# EAGLE design BOT (EAGLE 9.6.2)
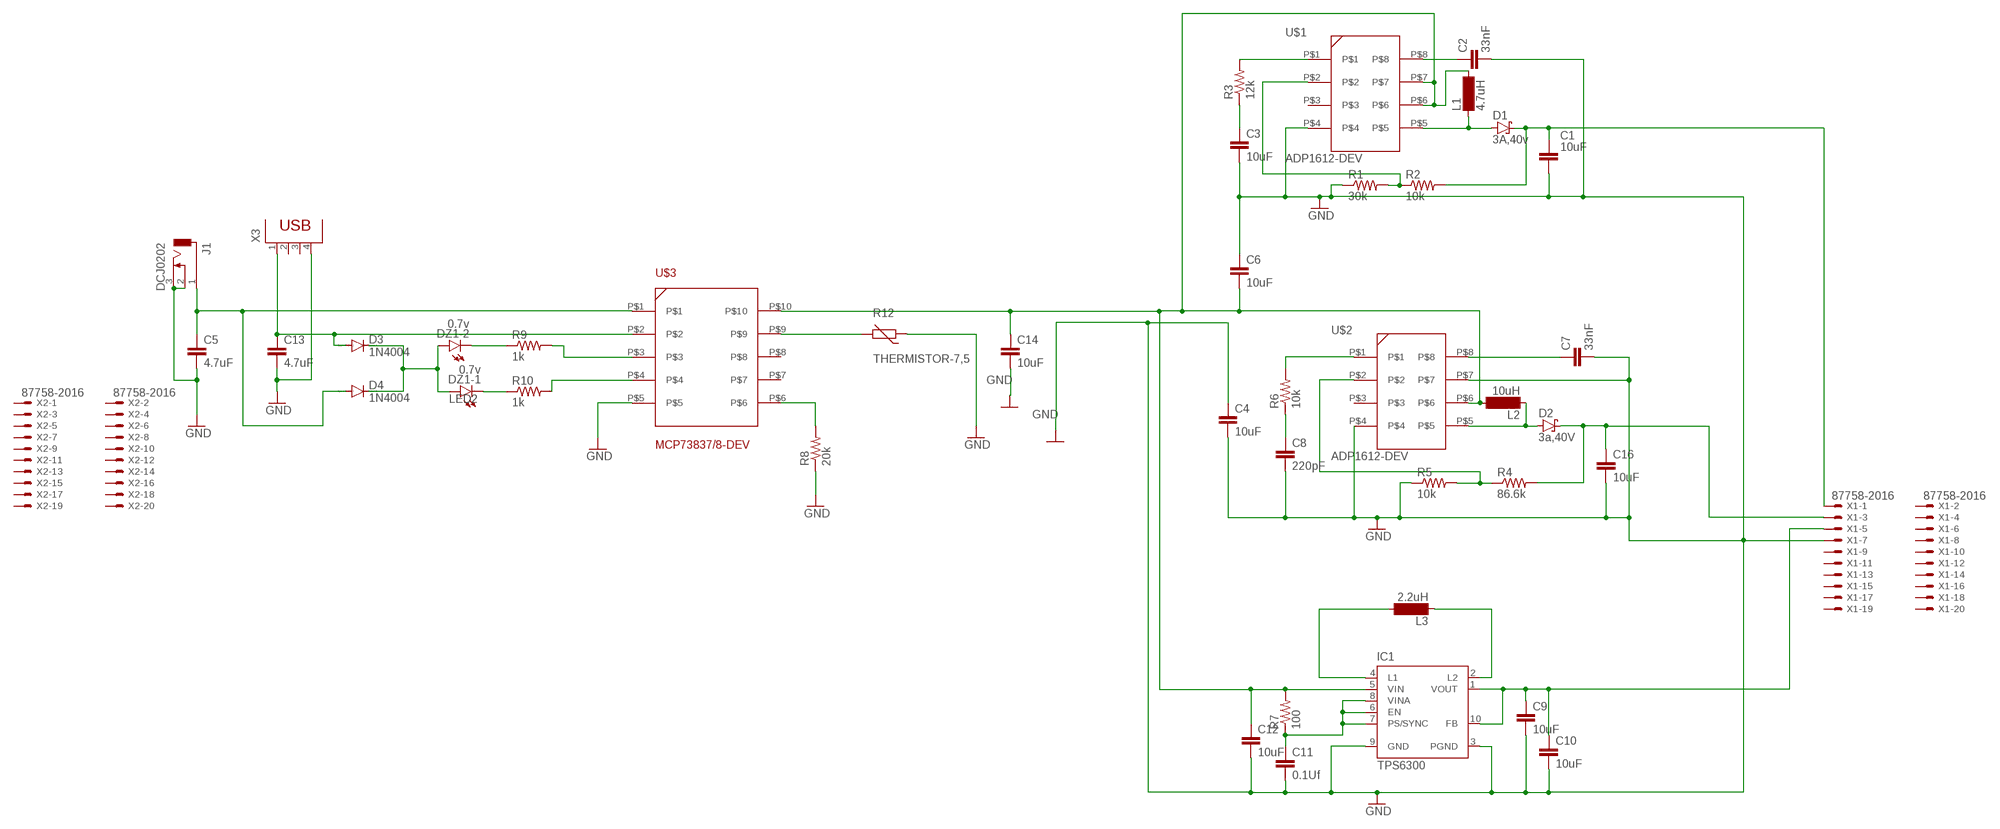
[diagram p0: schematic, sheet 1]

## Parts
C1  10uF  C  (no package)
C2  33nF  C2.5/2  [C2.5-2]
C3  10uF  C2.5/2  [C2.5-2]
C4  10uF  C2,5-3  [C2.5-3]
C5  4.7uF  C2.5/2  [C2.5-2]
C6  10uF  C2.5/2  [C2.5-2]
C7  33nF  C2,5-3  [C2.5-3]
C8  220pF  C2,5-3  [C2.5-3]
C9  10uF  C2,5-3  [C2.5-3]
C10  10uF  C2,5-3  [C2.5-3]
C11  0.1Uf  C2,5-3  [C2.5-3]
C12  10uF  C2,5-3  [C2.5-3]
C13  4.7uF  C2.5/2  [C2.5-2]
C14  10uF  C2.5/2  [C2.5-2]
C16  10uF  C2,5-3  [C2.5-3]
D1  3A,40v  BAT60J  [SOD323_ST]
D2  3a,40V  BAT60J  [SOD323_ST]
D3  1N4004  [DO41-10]
D4  1N4004  [DO41-10]
DZ1  0.7v  LZR182  [LZR182]
IC1  TPS6300  [DRC-S-PVSON-N10]
J1  DCJ0202  [DCJ0202]
L1  4.7uH  SD8  [SD8]
L2  10uH  SD8  [SD8]
L3  2.2uH  SD8  [SD8]
R1  30k  R-US_0204/5  [0204/5]
R2  10k  R-US_0204/5  [0204/5]
R3  12k  R-US_0204/5  [0204/5]
R4  86.6k  R-US_0204/5  [0204/5]
R5  10k  R-US_0204/5  [0204/5]
R6  10k  R-US_0204/5  [0204/5]
R7  100  R-US_0204/5  [0204/5]
R8  20k  R-US_0204/5  [0204/5]
R9  1k  R-US_0204/5  [0204/5]
R10  1k  R-US_0204/5  [0204/5]
R12  THERMISTOR-7,5  [R-7,5]
U$1  ADP1612-DEV  [MSOP-ADP1612]
U$2  ADP1612-DEV  [MSOP-ADP1612]
U$3  MCP73837/8-DEV  [MSOP-MCP73837/8]
X1  87758-2016  [87758-2016]
X2  87758-2016  [87758-2016]
X3  PN87520  [PN87520]

## Nets
GND: C1.2 C2.2 C3.2 C4.1 C4.2 C5.2 C6.1 C7.2 C8.2 C9.2 C10.2 C11.2 C12.2 C13.2 C14.2 C16.2 IC1.3(PGND) IC1.9(GND) J1.2 J1.3 R1.1 R5.1 R8.1 R12.1 U$1.P$4 U$2.P$4 U$2.P$7 U$3.P$5 X1.7 X3.4
LED2: D3.C D4.C DZ1.A1(-1:A) DZ1.A2(-2:A)
N$1: R3.2 U$1.P$1
N$2: C3.1 R3.1
N$3: C2.1 U$1.P$8
N$4: R8.2 U$3.P$6
N$5: D1.A L1.1 U$1.P$5
N$6: R1.2 R2.1 U$1.P$2
N$7: R6.2 U$2.P$1
N$8: C1.1 D1.C R2.2 X1.1
N$10: C8.1 R6.1
N$11: R9.2 U$3.P$3
N$12: D2.A L2.1 U$2.P$5
N$13: IC1.4(L1) L3.2
N$14: C7.1 U$2.P$8
N$15: R4.1 R5.2 U$2.P$2
N$16: C16.1 D2.C R4.2 X1.3
N$17: IC1.2(L2) L3.1
N$19: C9.1 C10.1 IC1.1(VOUT) IC1.10(FB) X1.5
N$20: C6.2 C12.1 C14.1 IC1.5(VIN) L1.2 L2.2 R7.2 U$1.P$6 U$1.P$7 U$2.P$6 U$3.P$10
N$22: C11.1 IC1.6(EN) IC1.7(PS/SYNC) IC1.8(VINA) R7.1
N$23: R12.2 U$3.P$9
N$24: DZ1.K2(-2:C) R9.1
N$25: DZ1.K1(-1:C) R10.1
N$28: C5.1 D4.A J1.1 U$3.P$1
N$30: R10.2 U$3.P$4
N$31: C13.1 D3.A U$3.P$2 X3.1
Unconnected: IC1.TH U$1.P$3 U$2.P$3 U$3.P$7 U$3.P$8 X1.2 X1.4 X1.6 X1.8 X1.9 X1.10 X1.11 X1.12 X1.13 X1.14 X1.15 X1.16 X1.17 X1.18 X1.19 X1.20 X2.1 X2.2 X2.3 X2.4 X2.5 X2.6 X2.7 X2.8 X2.9 X2.10 X2.11 X2.12 X2.13 X2.14 X2.15 X2.16 X2.17 X2.18 X2.19 X2.20 X3.2 X3.3

## Library data of the parts
C1 = ngspice-simulation:C: CAPACITOR naming: grid - package width
C2-C14 C16 = capacitor-wima:C: CAPACITOR naming: grid - package width
D1 D2 = diode:BAT60J: Schottky barrier diode Source: www.st.com, BAT60J.pdf
D3 D4 = diode:1N4004: DIODE general purpose rectifier, 1 A
DZ1 = led:LZR182: LED BLOCK 2 LEDs, Siemens
IC1 = texas:TPS6300*: HIGH EFFICIENT SINGLE INDUCTOR BUCK-BOOST CONVERTER WITH 1.8-A SWITCHES Source: http://focus.ti.com/lit/ds/symlink/tps63001.pdf; MPN: TPS63000DRCTG4; OC_FARNELL: 1511852; OC_NEWARK: 59M7217
J1 = con-jack:DCJ0202: DC POWER JACK Source: DCJ0202.pdf; OC_FARNELL: unknown; OC_NEWARK: unknown
L1-L3 = inductor-neosid:SD8: INDUCTOR nominal inductance; OC_FARNELL: unknown; OC_NEWARK: unknown
R1-R10 = rcl:R-US_: RESISTOR, American symbol; SPICEPREFIX: R
R12 = varistor:THERMISTOR: THERMISTOR
U$1 U$2 = num_cre(adp):ADP1612-DEV
U$3 = num_bat:MCP73837/8-DEV
X1 X2 = con-molex:87758-2016: 20 Pin - 2mm Dual Row Single Wafer, Vertical T/H HDR Source: http://www.molex.com/pdm_docs/sd/877580616_sd.pdf; MF: MOLEX; MPN: 87758-2016; OC_FARNELL: 7472374; OC_NEWARK: 25M5677
X3 = con-berg:PN87520: BERG USB connector; OC_FARNELL: unknown; OC_NEWARK: unknown

## Board
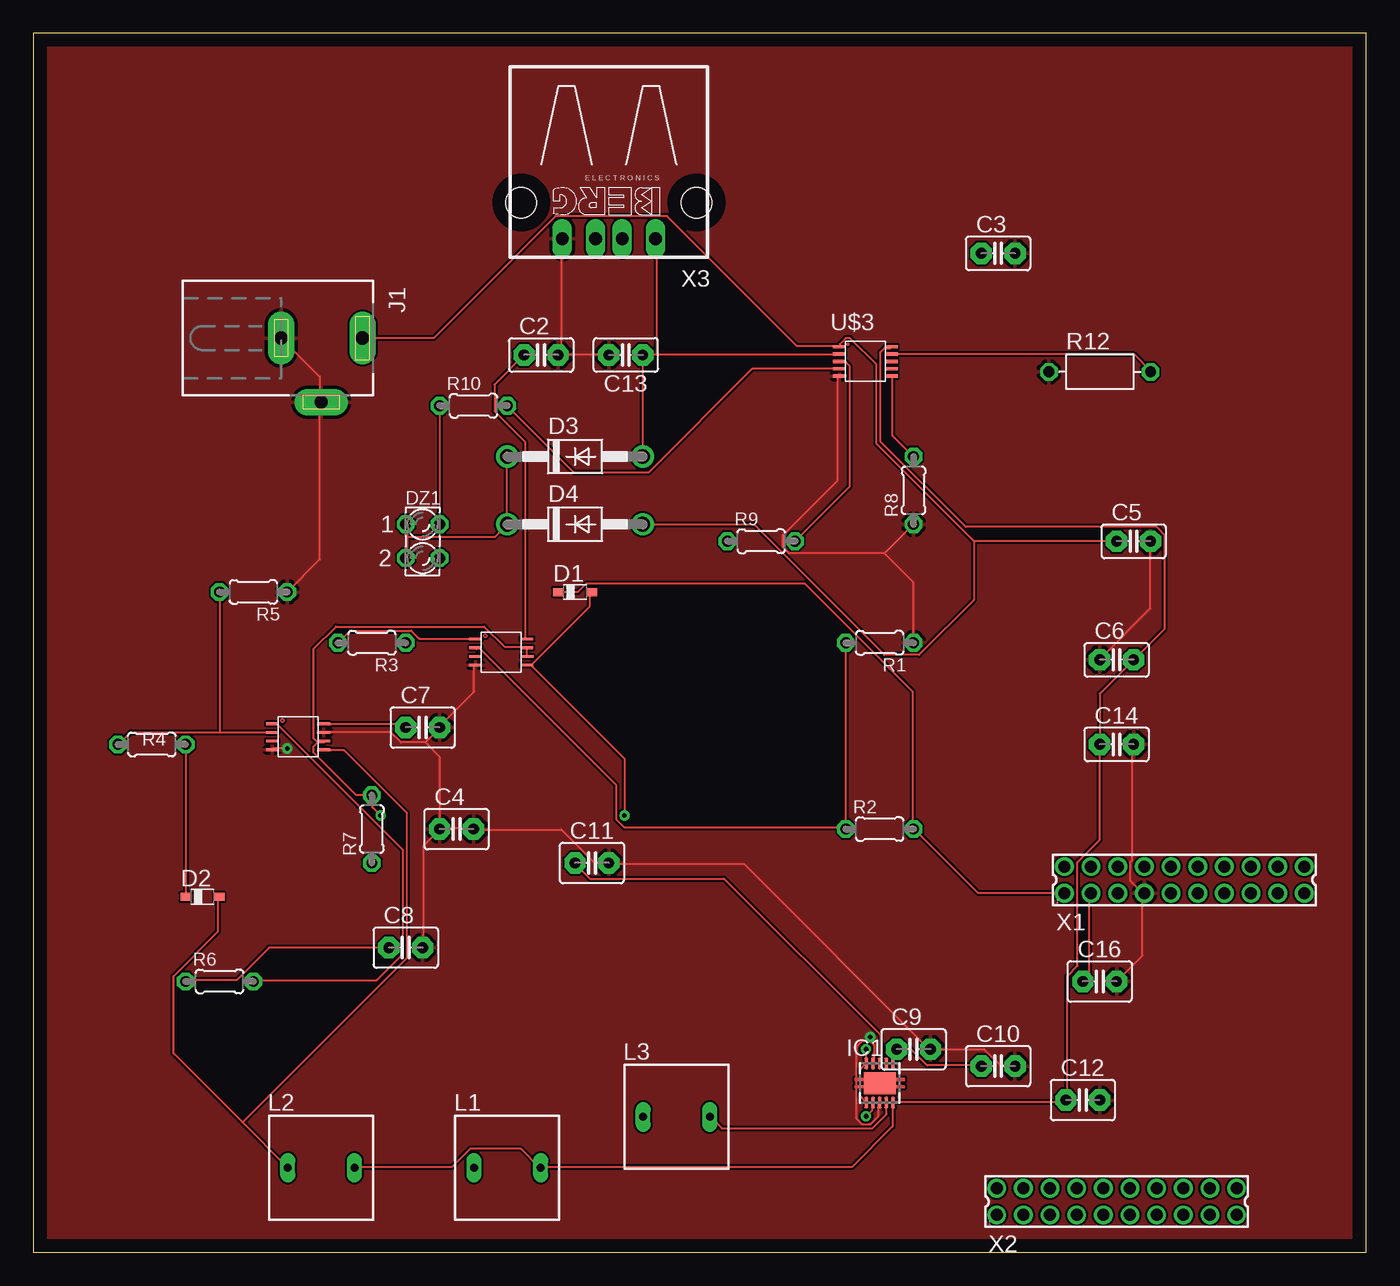
[diagram p1: board, top side]
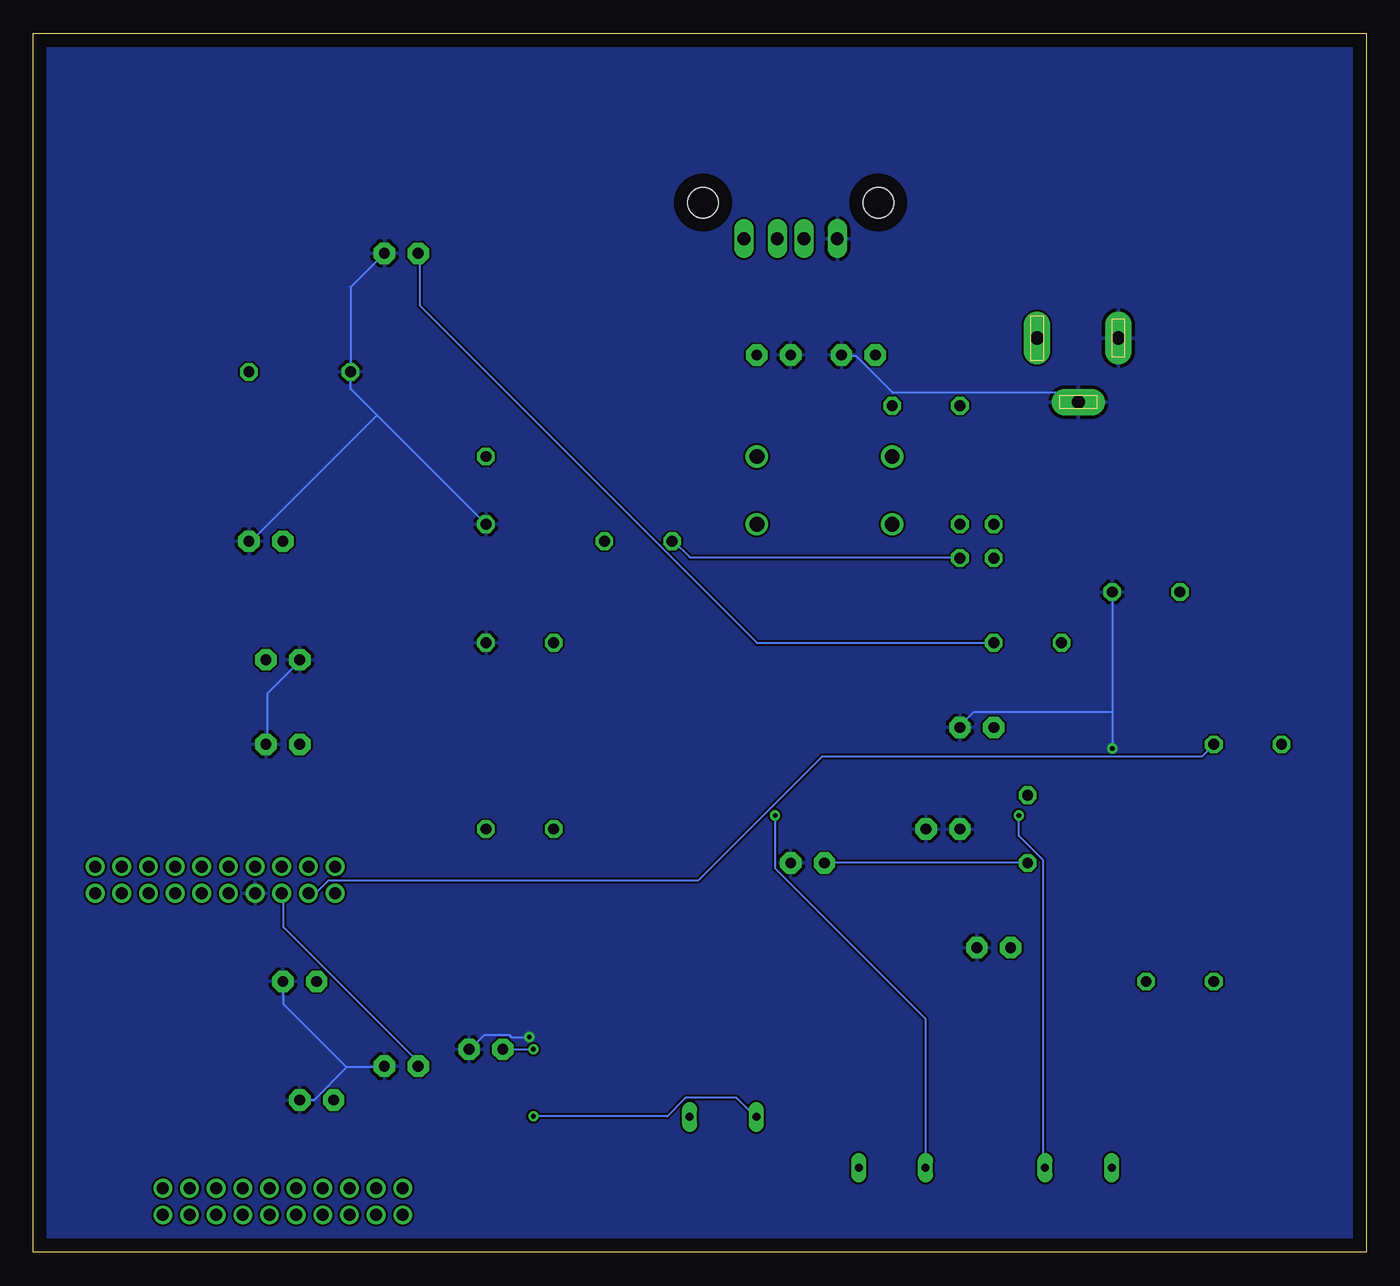
[diagram p2: board, bottom side, seen from below]

Size 100 x 91.43 mm. Coordinates in mm from the lower left corner, seen from the top.
Outline: 0,0 100,0 100,91.43 0,91.43 0,0
Copper layers (1*16): Top 0.035mm / dielectric 1.5mm / Bottom 0.035mm
Design rules "default": minimum track width 6mil, minimum drill 0.35mm, track to track 6mil, track to pad 6mil, pad to pad 6mil, via to via 6mil, smd to smd 6mil, copper to edge 40mil, drill to drill 6mil, minimum pad ring 10mil, minimum via ring 8mil, stop-mask expansion 4mil, vias tented up to drill 0mil, thermal gap 10mil

### Footprints (pad centres in the part's own frame; a part is rotated, then mirrored left to right if it is on the bottom)
C2.5-2 = drill 0.813 pad 1.6 octagon: 1 -1.27,0; 2 1.27,0
C2.5-3 = drill 0.813 pad 1.6 octagon: 1 -1.27,0; 2 1.27,0
SOD323_ST = smd 0.8 x 0.6: A 1.25,0; C -1.25,0
DO41-10 = drill 1.118: A 5.08,0; C -5.08,0
LZR182 = drill 0.813 octagon: A1 -1.27,1.27; A2 -1.27,-1.27; K1 1.27,1.27; K2 1.27,-1.27
DRC-S-PVSON-N10 = smd 0.28 x 0.85: 1 -1,-1.475; 2 -0.5,-1.475; 3 0,-1.475; 4 0.5,-1.475; 5 1,-1.475; 6 1,1.475; 7 0.5,1.475; 8 0,1.475; 9 -0.5,1.475; 10 -1,1.475 | smd 2.4 x 1.65: TH 0,0
DCJ0202 = drill 1 pad 2 long: 1 0,3.1; 2 4.8,0; 3 0,-3
SD8 = drill 0.6 long: 1 -2.5,0; 2 2.5,0
0204/5 = drill 0.813 octagon: 1 -2.54,0; 2 2.54,0
R-7,5 = drill 0.813 octagon: 1 -3.81,0; 2 3.81,0
MSOP-ADP1612 = smd 0.95 x 0.2: P$1 0.15,1.55; P$2 0.15,0.9; P$3 0.15,0.25; P$4 0.15,-0.4; P$5 4,-0.4; P$6 4.025,0.25; P$7 4,0.9; P$8 4,1.55
MSOP-MCP73837/8 = smd 0.95 x 0.25: P$1 -1.75,3.15; P$2 -1.75,2.6; P$3 -1.75,2.05; P$4 -1.75,1.5; P$5 -1.75,0.95; P$6 2.15,0.95; P$7 2.15,1.5; P$8 2.15,2.05; P$9 2.15,2.6; P$10 2.15,3.15
87758-2016 = drill 0.9 pad 1.27: 1 -9,-1; 2 -9,1; 3 -7,-1; 4 -7,1; 5 -5,-1; 6 -5,1; 7 -3,-1; 8 -3,1; 9 -1,-1; 10 -1,1; 11 1,-1; 12 1,1; 13 3,-1; 14 3,1; 15 5,-1; 16 5,1; 17 7,-1; 18 7,1; 19 9,-1; 20 9,1
PN87520 = drill 0.95 long: 1 -3.5,2.71; 2 -1,2.71; 3 1,2.71; 4 3.5,2.71 | hole 2.3: -6.57,0; 6.57,0

### Placement (x,y rotation side)
C2  38.1,67.31 0 top
C3  72.39,74.93 0 top
C4  31.75,31.75 0 top
C5  82.55,53.34 0 top
C6  81.28,44.45 0 top
C7  29.21,39.37 0 top
C8  27.94,22.86 0 top
C9  66.04,15.24 0 top
C10  72.39,13.97 0 top
C11  41.91,29.21 0 top
C12  78.74,11.43 0 top
C13  44.45,67.31 180 top
C14  81.28,38.1 0 top
C16  80.01,20.32 0 top
D1  40.64,49.53 0 top
D2  12.7,26.67 0 top
D3  40.64,59.69 0 top
D4  40.64,54.61 0 top
DZ1  29.21,53.34 0 top
IC1  63.5,12.7 0 top
J1  21.59,68.58 270 top
L1  35.56,6.35 0 top
L2  21.59,6.35 0 top
L3  48.26,10.16 0 top
R1  63.5,45.72 180 top
R2  63.5,31.75 0 top
R3  25.4,45.72 180 top
R4  8.89,38.1 0 top
R5  16.51,49.53 180 top
R6  13.97,20.32 0 top
R7  25.4,31.75 90 top
R8  66.04,57.15 90 top
R9  54.61,53.34 0 top
R10  33.02,63.5 0 top
R12  80.01,66.04 0 top
U$1  33.02,44.45 0 top
U$2  17.78,38.1 0 top
U$3  62.23,64.77 0 top
X1  86.36,27.94 0 top
X2  81.28,3.81 0 top
X3  43.18,78.74 180 top

### Tracks (layer width: path | path; a pad name or v marks a point on that pad's centre or on a via)
GND  (via drill 0.35)
  Top 0.152: C8.2 29.26,22.86 29.26,30.48 30.48,31.7 C4.1 30.48,31.85 | 30.48,31.85 32.92,31.85 C4.2 33.07,31.7 39.62,31.7 42.06,29.26 43.13,29.26 C11.2 43.28,29.11 53.34,29.11 67.21,15.24 C9.2 71.32,15.24 72.54,14.02 73.61,14.02 C10.2 | 39.47,67.36 39.62,67.51 39.62,75.89 X3.4 | 39.47,67.36 43.13,67.36 C13.2 | 39.47,67.36 C2.2 | J1.3 21.49,65.68 21.49,63.86 J1.2 21.49,63.7 21.49,51.97 R5.1 | v19.05,37.8 17.98,37.8 U$2.P$4 | 29.41,38.25 27.58,38.25 26.82,39.01 21.79,39.01 U$2.P$7 | 29.41,38.25 30.48,39.32 C7.2 30.48,39.47 33.07,42.06 33.07,44.04 U$1.P$4 | 30.48,31.85 30.48,37.19 29.41,38.25 | 63.86,52.43 56.69,52.43 56.24,52.88 56.24,53.8 60.35,57.91 60.35,65.68 U$3.P$5 | R8.1 63.86,52.43 | 63.86,52.43 65.99,50.29 65.99,45.72 R1.1 | C5.2 83.82,48.31 80.01,44.5 C6.1 | C16.2 83.21,22.25 83.21,26.82 X1.7 83.21,26.98 82.3,27.89 82.3,29.26 82.45,29.41 82.45,38.1 C14.2 | 62.79,15.85 62.18,15.85 61.72,15.39 61.72,10.06 62.18,9.6 62.79,9.6 63.4,10.21 63.4,11.12 IC1.3 | 62.79,15.85 63.09,15.54 63.09,14.33 IC1.9 | v62.79,16.15 62.79,15.85
  Bottom 0.152: R5.1 19.05,40.54 | 19.05,40.54 v19.05,37.8 | 19.05,40.54 29.41,40.54 30.48,39.47 C7.2 | C2.2 39.32,67.21 38.25,67.21 35.51,64.47 22.25,64.47 21.64,63.86 J1.2 | C3.2 76.2,72.39 R12.1 76.2,64.77 74.22,62.79 | R8.1 74.22,62.79 | C14.2 82.45,38.1 82.45,41.91 80.01,44.35 C6.1 | v62.79,16.15 64.16,16.15 64.31,16.31 66.14,16.31 67.21,15.24 C9.2 | C12.2 78.94,11.43 76.5,13.87 | 76.5,13.87 73.76,13.87 C10.2 | 76.5,13.87 81.23,18.59 81.23,20.27 C16.2 | 74.22,62.79 83.67,53.34 C5.2
  pour Top: -1.27,93.98 -1.27,-3.81 104.14,-3.81 104.14,93.98 0,93.98
  pour Bottom: -2.54,96.52 -2.54,-7.62 -1.27,-8.89 104.14,-8.89 107.95,-5.08 107.95,95.25 104.14,99.06 0,99.06
LED2
  Top 0.152: 28.04,53.65 28.04,54.56 DZ1.A1 | 28.04,53.65 28.04,52.12 DZ1.A2 | D3.C 35.51,59.59 35.51,54.71 D4.C 34.59,53.65 28.04,53.65
N$1
  Top 0.152: R3.2 23.77,46.63 28.35,46.63 28.96,46.02 33.07,46.02 U$1.P$1
N$2
  Bottom 0.152: R3.1 45.72,45.72 71.02,71.02 71.02,74.83 C3.1
N$3
  Top 0.152: C2.1 34.59,65.08 34.59,63.09 36.88,60.81 36.88,46.02 U$1.P$8
N$4
  Top 0.152: R8.2 64.47,61.27 64.47,65.68 U$3.P$6
N$5  (via drill 0.35)
  Top 0.152: 37.34,44.04 41.76,48.46 41.76,49.53 D1.A | 37.34,44.04 37.03,44.04 U$1.P$5 37.34,44.04 | v44.35,32.77 44.35,37.03 37.34,44.04
  Bottom 0.152: v44.35,32.77 44.35,28.8 33.07,17.53 33.07,6.4 L1.1
N$6
  Top 0.152: 60.96,31.85 44.35,31.85 43.74,32.46 43.74,35.05 33.53,45.26 33.22,45.26 U$1.P$2 | 60.96,31.85 R1.2 | 60.96,31.85 R2.1
N$7
  Top 0.152: U$2.P$1 17.98,39.62 18.29,39.62 27.74,30.18 27.74,22.4 25.76,20.42 16.61,20.42 R6.2
N$8
  Top 0.152: D1.C 40.84,49.53 41.45,50.14 57.91,50.14 65.99,42.06 65.99,31.85 R2.2 66.14,31.7 70.87,26.98 77.27,26.98 X1.1
N$10
  Top 0.152: C8.1 17.68,22.86 15.24,20.42 11.43,20.42 R6.1
N$11
  Top 0.152: R9.2 61.27,57.45 61.27,66.45 60.96,66.75 60.5,66.75 U$3.P$3
N$12
  Top 0.152: 15.7,9.75 19.05,6.4 L2.1 | 15.7,9.75 10.52,14.94 10.52,20.73 13.87,24.08 13.87,26.67 D2.A | 15.7,9.75 28.04,22.1 28.04,32.92 23.32,37.64 21.79,37.64 U$2.P$5
N$13
  Top 0.152: IC1.4 64.01,11.12 64.01,10.36 62.94,9.3 51.66,9.3 50.9,10.06 L3.2
N$14
  Top 0.152: U$2.P$8 21.79,39.62 27.74,39.62 27.89,39.47 C7.1
N$15
  Top 0.152: 14.02,39.01 7.32,39.01 6.4,38.1 R4.1 | 14.02,39.01 17.83,39.01 U$2.P$2 | 14.02,39.01 14.02,49.53 R5.2
N$16
  Top 0.152: X1.3 79.25,26.82 79.25,20.88 78.79,20.42 C16.1 | R4.2 11.43,26.67 D2.C
  Bottom 0.152: R4.2 12.34,37.19 40.84,37.19 50.14,27.89 77.88,27.89 78.79,26.98 79.25,26.98 X1.3
N$17  (via drill 0.35)
  Top 0.152: v62.48,10.21 62.94,10.67 62.94,11.12 IC1.2
  Bottom 0.152: v62.48,10.21 52.43,10.21 51.05,11.58 47.24,11.58 45.87,10.21 L3.1
N$19  (via drill 0.35)
  Top 0.152: IC1.1 62.48,11.28 62.03,11.73 62.03,13.72 62.48,14.17 IC1.10 62.48,14.33 v62.48,15.24 | C9.1 65.84,15.24 67.06,14.02 71.02,14.02 C10.1
  Bottom 0.152: C9.1 v62.48,15.24 | X1.5 81.23,26.82 81.23,24.38 71.17,14.33 71.17,14.02 C10.1
N$20  (via drill 0.35)
  Top 0.152: U$3.P$10 64.31,67.82 63.86,67.82 63.55,67.51 63.55,60.81 69.95,54.41 84.28,54.41 84.89,53.8 84.89,46.79 C6.2 80.01,41.91 C14.1 80.01,30.94 78.33,29.26 78.33,21.49 77.57,20.73 77.57,11.43 C12.1 77.42,11.43 77.27,11.28 64.62,11.28 IC1.5 64.47,11.12 64.47,9.45 61.42,6.4 38.1,6.4 L1.2 37.95,6.4 36.58,7.77 32.77,7.77 31.39,6.4 24.23,6.4 L2.2 | U$1.P$6 37.03,44.65 37.03,45.26 U$1.P$7 36.88,45.41 35.36,45.41 33.83,46.94 22.71,46.94 21.03,45.26 21.03,38.56 21.34,38.25 | 21.34,38.25 21.79,38.25 U$2.P$6 21.34,38.25 | 21.34,38.25 21.03,37.95 21.03,37.49 24.23,34.29 R7.2 25.45,34.29 25.45,33.38 v26.06,32.77
  Bottom 0.152: v26.06,32.77 26.06,31.24 24.23,29.41 24.23,6.4 L2.2
N$22
  Top 0.152: IC1.7 63.55,14.17 IC1.8 63.55,14.33 63.55,16.31 51.82,28.04 41.76,28.04 40.69,29.11 C11.1 | IC1.7 64.47,14.17 IC1.6 | IC1.7
  Bottom 0.152: R7.1 25.45,29.26 40.54,29.26 C11.1
N$23
  Top 0.152: U$3.P$9 64.47,67.36 82.6,67.36 83.82,66.14 R12.2
N$24
  Bottom 0.152: DZ1.K2 30.48,52.12 50.75,52.12 51.97,53.34 R9.1
N$25
  Top 0.152: R10.1 DZ1.K1
N$28
  Top 0.152: 70.56,53.34 63.25,60.66 63.25,66.6 61.27,68.58 60.96,68.58 60.5,68.12 60.5,67.97 U$3.P$1 60.35,67.97 57.3,67.97 47.55,77.72 39.17,77.72 30.02,68.58 J1.1 | C5.1 70.56,53.34 | 70.56,53.34 70.56,48.92 66.45,44.81 63.86,44.81 54.1,54.56 45.72,54.56 D4.A
N$30
  Top 0.152: R10.2 40.54,58.52 46.18,58.52 53.95,66.29 60.35,66.29 U$3.P$4
N$31
  Top 0.152: 46.79,67.36 45.72,67.36 C13.1 D3.A | 46.79,67.36 60.35,67.36 U$3.P$2 | 46.79,67.36 46.79,75.89 X3.1